# Altium schematic sheet Dragonflyte.SchDoc
size A; DocumentNumber: 1; SheetNumber: 1
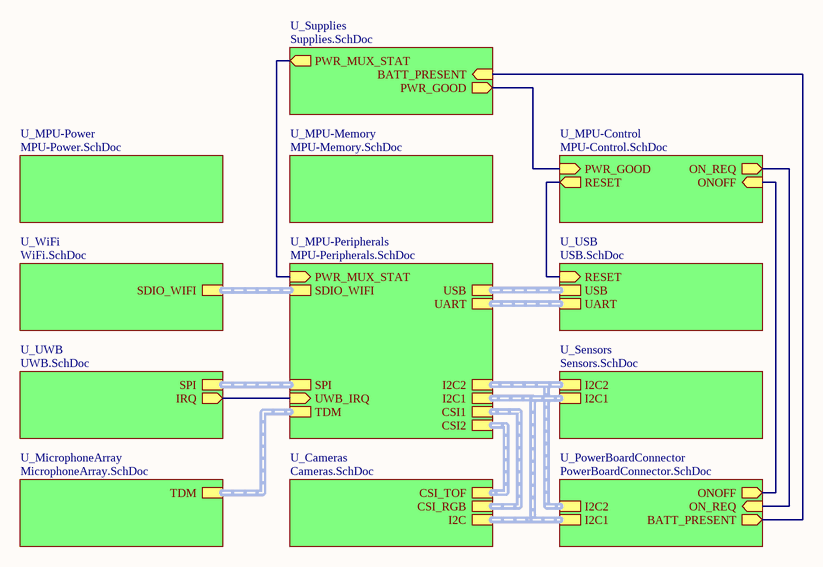
[diagram p0: Dragonflyte.SchDoc]

## Sub-sheets
U_Cameras = Cameras.SchDoc: CSI_TOF (harness CSI12), I2C (harness I2C), CSI_RGB (harness CSI8)
U_MicrophoneArray = MicrophoneArray.SchDoc: TDM (harness TDM)
U_MPU-Control = MPU-Control.SchDoc: PWR_GOOD (in), RESET (out), ON_REQ (out), ONOFF (in)
U_MPU-Memory = MPU-Memory.SchDoc: no entries
U_MPU-Peripherals = MPU-Peripherals.SchDoc: SDIO_WIFI (harness SDIO), UART (harness UART), USB (harness USB), TDM (harness TDM), SPI (harness SPI), CSI1 (harness CSI8), I2C2 (harness I2C), I2C1 (harness I2C), CSI2 (harness CSI12), UWB_IRQ (in), PWR_MUX_STAT (in)
U_MPU-Power = MPU-Power.SchDoc: no entries
U_PowerBoardConnector = PowerBoardConnector.SchDoc: ONOFF (out), ON_REQ (in), I2C1 (harness I2C), I2C2 (harness I2C), BATT_PRESENT (out)
U_Sensors = Sensors.SchDoc: I2C1 (harness I2C), I2C2 (harness I2C)
U_Supplies = Supplies.SchDoc: PWR_GOOD (out), PWR_MUX_STAT (out), BATT_PRESENT (in)
U_USB = USB.SchDoc: RESET (in), USB (harness USB), UART (harness UART)
U_UWB = UWB.SchDoc: SPI (harness SPI), IRQ (out)
U_WiFi = WiFi.SchDoc: SDIO_WIFI (harness SDIO)

## Nets
(unnamed): sheet U_Supplies/PWR_GOOD, sheet U_MPU-Control/PWR_GOOD
(unnamed): sheet U_Supplies/PWR_MUX_STAT, sheet U_MPU-Peripherals/PWR_MUX_STAT
(unnamed): sheet U_Supplies/BATT_PRESENT, sheet U_PowerBoardConnector/BATT_PRESENT
(unnamed): sheet U_MPU-Control/RESET, sheet U_USB/RESET
(unnamed): sheet U_MPU-Control/ON_REQ, sheet U_PowerBoardConnector/ON_REQ
(unnamed): sheet U_MPU-Control/ONOFF, sheet U_PowerBoardConnector/ONOFF
(unnamed): sheet U_MPU-Peripherals/UWB_IRQ, sheet U_UWB/IRQ

## Buses and harness runs
harness sheet U_Cameras/CSI_RGB = sheet U_MPU-Peripherals/CSI1
harness sheet U_Cameras/CSI_TOF = sheet U_MPU-Peripherals/CSI2
harness sheet U_Cameras/I2C = sheet U_MPU-Peripherals/I2C1 = sheet U_PowerBoardConnector/I2C1 = sheet U_Sensors/I2C1
harness sheet U_MicrophoneArray/TDM = sheet U_MPU-Peripherals/TDM
harness sheet U_MPU-Peripherals/I2C2 = sheet U_PowerBoardConnector/I2C2 = sheet U_Sensors/I2C2
harness sheet U_MPU-Peripherals/SDIO_WIFI = sheet U_WiFi/SDIO_WIFI
harness sheet U_MPU-Peripherals/SPI = sheet U_UWB/SPI
harness sheet U_MPU-Peripherals/UART = sheet U_USB/UART
harness sheet U_MPU-Peripherals/USB = sheet U_USB/USB